# EAGLE schematic kontrol (EAGLE 9.6.1)
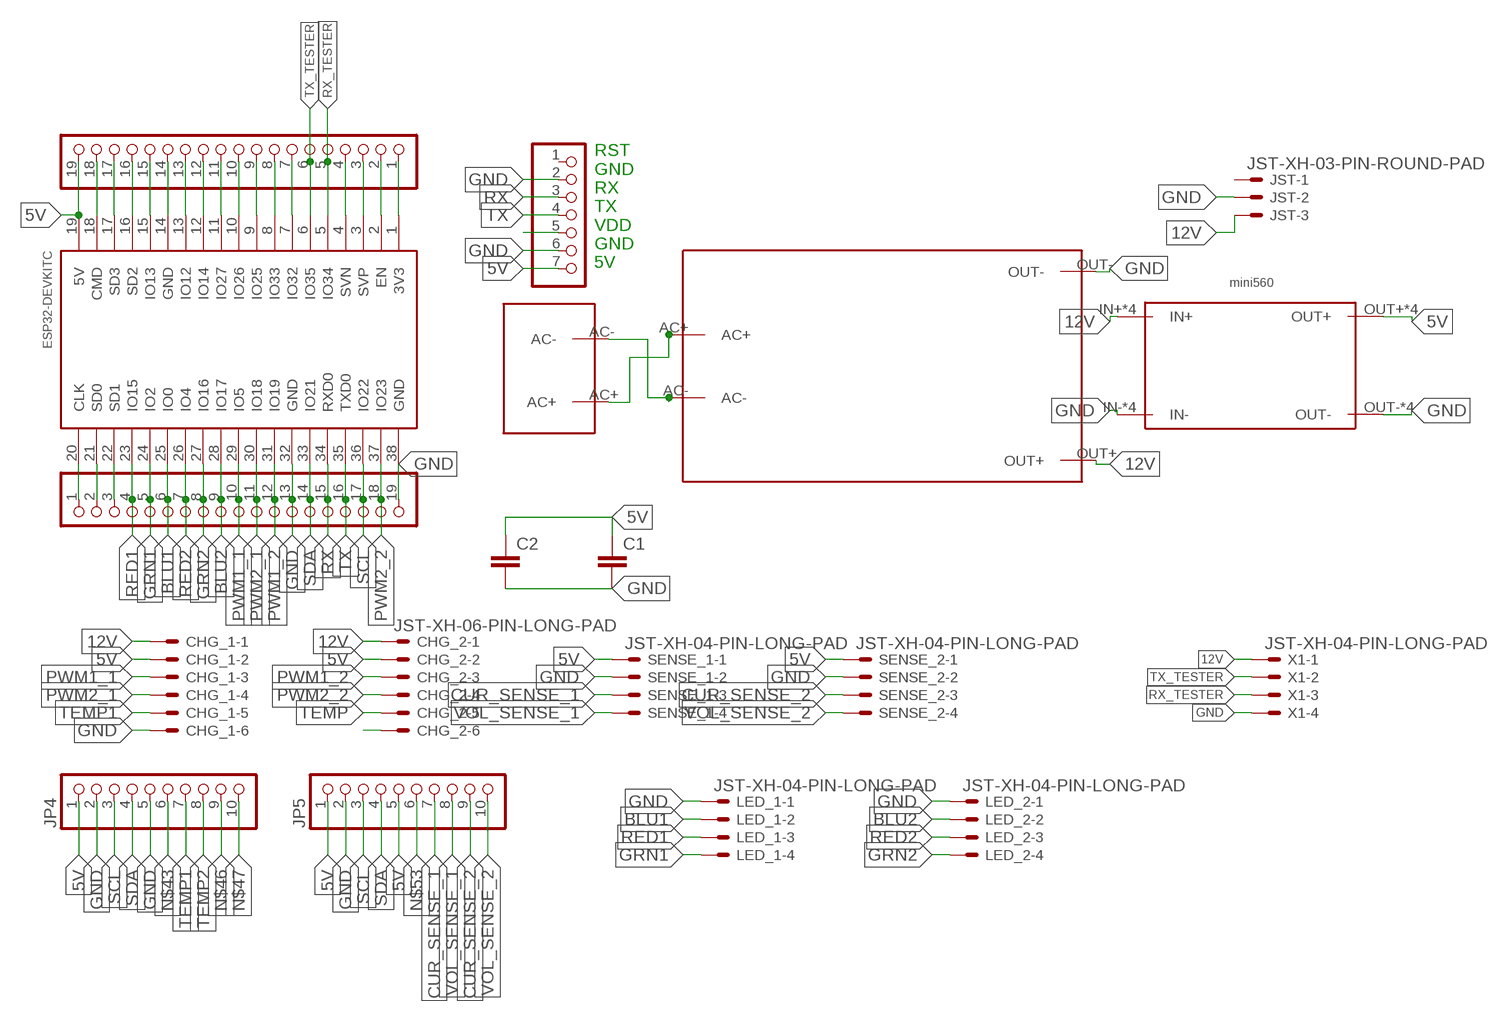
[diagram p0: schematic, sheet 1]

## Parts
AC_CONNECTOR1  AC_CONNECTOR  [AC_CONNECTOR]
C1  C2.5/5  [C2.5-5]
C2  C2.5/6  [C2.5-6]
CHG_1  JST-XH-06-PIN-LONG-PAD  [JST-XH-06-PACKAGE-LONG-PAD]
CHG_2  JST-XH-06-PIN-LONG-PAD  [JST-XH-06-PACKAGE-LONG-PAD]
HI_LINK1  HI_LINK  [HI_LINK]
JP1  PINHD-1X7  [1X07]
JP2  PINHD-1X19  [1X19]
JP3  PINHD-1X19  [1X19]
JP4  PINHD-1X10  [1X10]
JP5  PINHD-1X10  [1X10]
JST  JST-XH-03-PIN-ROUND-PAD  [JST-XH-03-PACKAGE-ROUND-PAD]
LED_1  JST-XH-04-PIN-LONG-PAD  [JST-XH-04-PACKAGE-LONG-PAD]
LED_2  JST-XH-04-PIN-LONG-PAD  [JST-XH-04-PACKAGE-LONG-PAD]
MINI1  MINI560  [MINI560]
SENSE_1  JST-XH-04-PIN-LONG-PAD  [JST-XH-04-PACKAGE-LONG-PAD]
SENSE_2  JST-XH-04-PIN-LONG-PAD  [JST-XH-04-PACKAGE-LONG-PAD]
U$1  ESP32DEVKITC  [ESP32-DEVKITC]
X1  JST-XH-04-PIN-LONG-PAD  [JST-XH-04-PACKAGE-LONG-PAD]

## Nets
5V: C1.1 C2.1 CHG_1.2 CHG_2.2 JP1.7 JP3.19 JP4.1 JP5.1 JP5.5 MINI1.OUT+ MINI1.OUT+1(OUT+) MINI1.OUT+2(OUT+) MINI1.OUT+3(OUT+) SENSE_1.1 SENSE_2.1 U$1.19(5V)
12V: CHG_1.1 CHG_2.1 HI_LINK1.OUT+ JST.3 MINI1.IN+ MINI1.IN+1(IN+) MINI1.IN+2(IN+) MINI1.IN+3(IN+) X1.1
BLU1: JP2.6 LED_1.2 U$1.25(IO0)
BLU2: JP2.9 LED_2.2 U$1.28(IO17)
CUR_SENSE_1: JP5.7 SENSE_1.3
CUR_SENSE_2: JP5.9 SENSE_2.3
GND: C1.2 C2.2 CHG_1.6 CHG_2.6 HI_LINK1.OUT- JP1.2 JP1.6 JP2.13 JP2.19 JP4.2 JP4.5 JP5.2 JST.2 LED_1.1 LED_2.1 MINI1.IN- MINI1.IN-1(IN-) MINI1.IN-2(IN-) MINI1.IN-3(IN-) MINI1.OUT- MINI1.OUT-1(OUT-) MINI1.OUT-2(OUT-) MINI1.OUT-3(OUT-) SENSE_1.2 SENSE_2.2 U$1.32(GND) U$1.38(GND) X1.4
GRN1: JP2.5 LED_1.4 U$1.24(IO2)
GRN2: JP2.8 LED_2.4 U$1.27(IO16)
N$2: JP2.1 U$1.20(CLK)
N$3: JP2.2 U$1.21(SD0)
N$4: JP2.3 U$1.22(SD1)
N$16: AC_CONNECTOR1.AC+ HI_LINK1.AC+
N$18: JP1.5
N$19: JP3.1 U$1.1(3V3)
N$20: JP3.2 U$1.2(EN)
N$21: JP3.3 U$1.3(SVP)
N$22: JP3.4 U$1.4(SVN)
N$25: JP3.7 U$1.7(IO32)
N$26: JP3.8 U$1.8(IO33)
N$27: JP3.9 U$1.9(IO25)
N$28: JP3.10 U$1.10(IO26)
N$29: JP3.11 U$1.11(IO27)
N$30: JP3.12 U$1.12(IO14)
N$31: JP3.13 U$1.13(IO12)
N$32: JP3.14 U$1.14(GND)
N$33: JP3.15 U$1.15(IO13)
N$34: JP3.16 U$1.16(SD2)
N$35: JP3.17 U$1.17(SD3)
N$36: JP3.18 U$1.18(CMD)
N$37: AC_CONNECTOR1.AC- HI_LINK1.AC-
N$43: JP4.6
N$46: JP4.9
N$47: JP4.10
N$53: JP5.6
PWM1_1: CHG_1.3 JP2.10 U$1.29(IO5)
PWM1_2: CHG_2.3 JP2.12 U$1.31(IO19)
PWM2_1: CHG_1.4 JP2.11 U$1.30(IO18)
PWM2_2: CHG_2.4 JP2.18 U$1.37(IO23)
RED1: JP2.4 LED_1.3 U$1.23(IO15)
RED2: JP2.7 LED_2.3 U$1.26(IO4)
RX: JP1.3 JP2.15 U$1.34(RXD0)
RX_TESTER: JP3.5 U$1.5(IO34) X1.3
SCL: JP2.17 JP4.3 JP5.3 U$1.36(IO22)
SDA: JP2.14 JP4.4 JP5.4 U$1.33(IO21)
TEMP: CHG_2.5
TEMP1: CHG_1.5 JP4.7
TEMP2: JP4.8
TX: JP1.4 JP2.16 U$1.35(TXD0)
TX_TESTER: JP3.6 U$1.6(IO35) X1.2
VOL_SENSE_1: JP5.8 SENSE_1.4
VOL_SENSE_2: JP5.10 SENSE_2.4
Unconnected: JP1.1 JST.1

## Notes on the sheet
- RST
  GND
  RX
  TX
  VDD
  GND
  5V

## Library data of the parts
AC_CONNECTOR1 = AC Connector:AC_CONNECTOR
C1 C2 = capacitor-wima:C: CAPACITOR naming: grid - package width
CHG_1 CHG_2 = JST XH Connectors v1-0:JST-XH-06-PIN: JST XH Connector 2 Pin Wire to board connector. Pitch: 2,54 mm, (0.100") Number of pins: 6 Created by Rembrandt Electronics www.rembrandtelectronics.com
HI_LINK1 = Hi Link:HI_LINK
JP1 = pinhead:PINHD-1X7: PIN HEADER
JP2 JP3 = pinhead:PINHD-1X19: PIN HEADER
JP4 JP5 = pinhead:PINHD-1X10: PIN HEADER
JST = JST XH Connectors v1-0:JST-XH-03-PIN: JST XH Connector 2 Pin Wire to board connector. Pitch: 2,54 mm, (0.100") Number of pins: 3 Created by Rembrandt Electronics www.rembrandtelectronics.com
LED_1 LED_2 SENSE_1 SENSE_2 = JST XH Connectors v1-0:JST-XH-04-PIN: JST XH Connector 2 Pin Wire to board connector. Pitch: 2,54 mm, (0.100") Number of pins: 4 Created by Rembrandt Electronics www.rembrandtelectronics.com
MINI1 = mini560:MINI560
U$1 = ESP32-DEVKITC:ESP32DEVKITC
X1 = Rembrandt Electronics - JST XH Connectors v1-0:JST-XH-04-PIN: JST XH Connector 2 Pin Wire to board connector. Pitch: 2,54 mm, (0.100") Number of pins: 4 Created by Rembrandt Electronics www.rembrandtelectronics.com

## Net classes
1 3A: width 3.302 mm, clearance 0.61 mm